# EAGLE design shield (EAGLE 5.11)
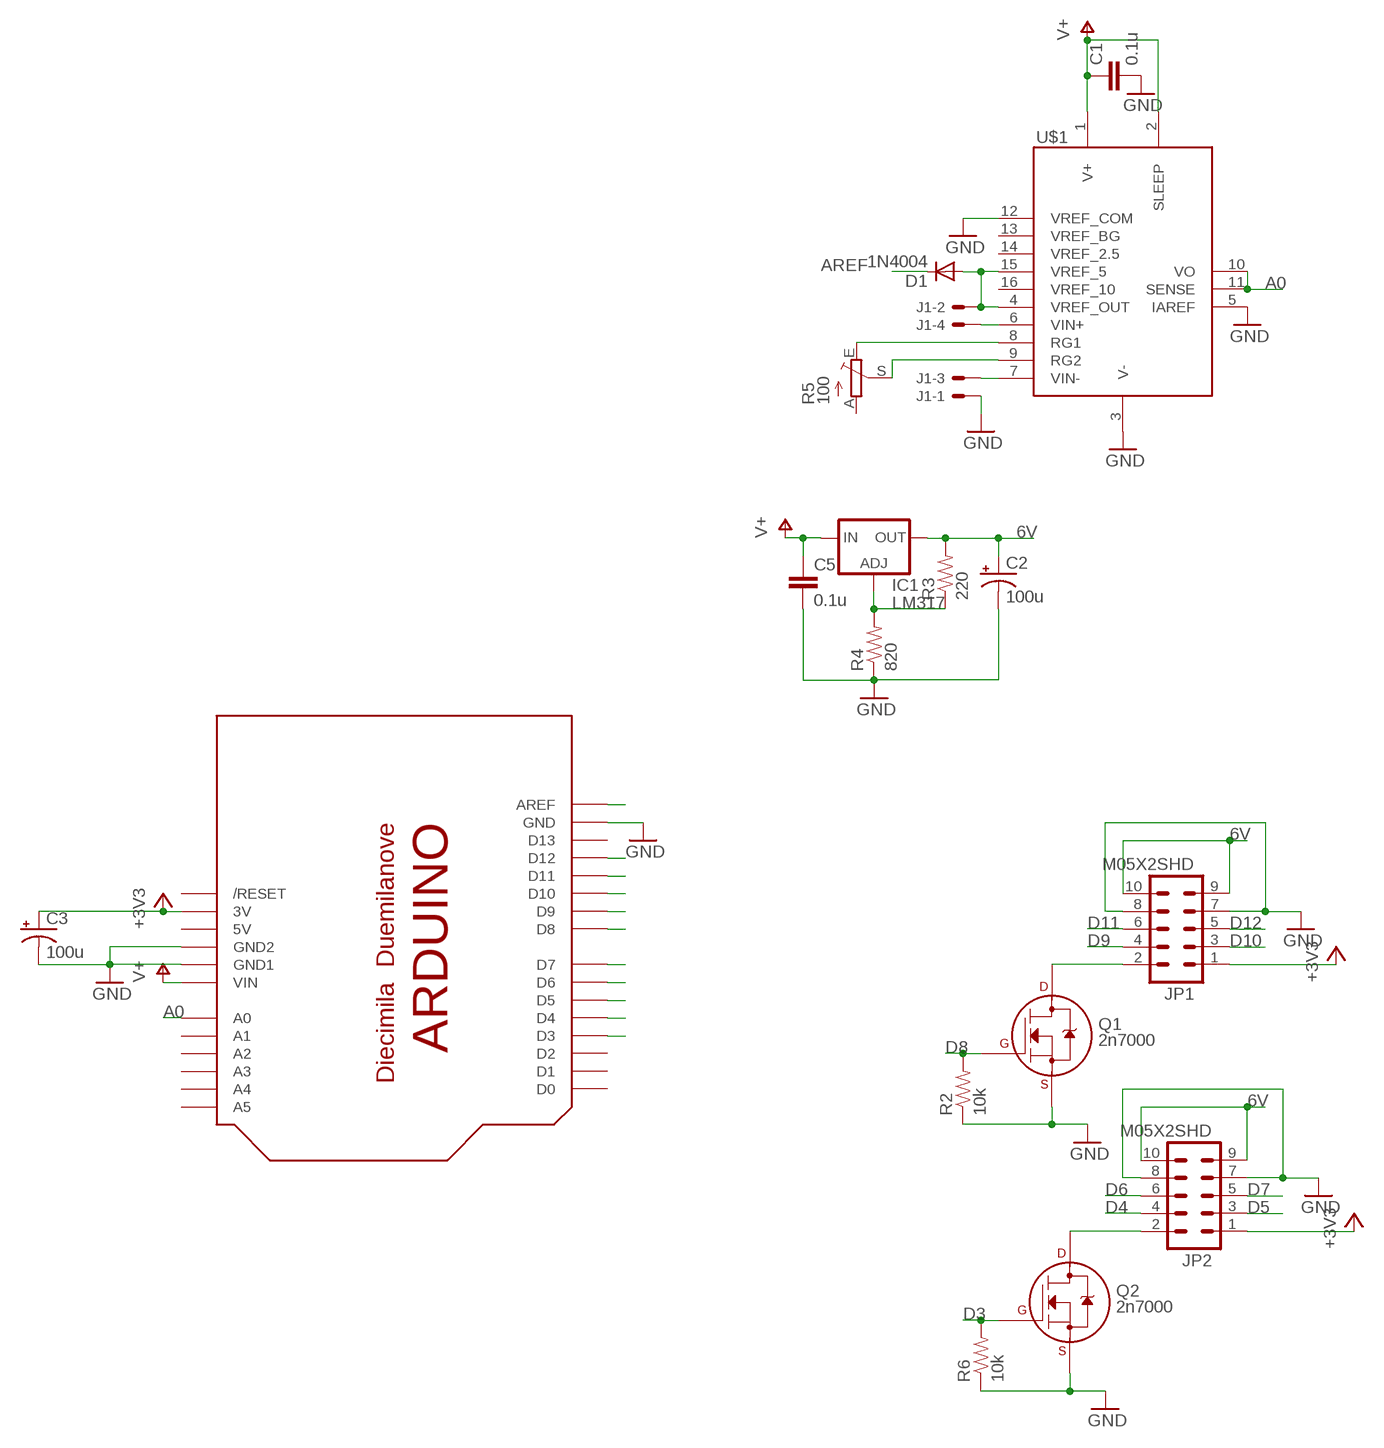
[diagram p0: schematic, sheet 1]

## Parts
C1  0.1u  CAPPTH  [CAP-PTH-SMALL]
C2  100u  CAP_POLPTH1  [CPOL-RADIAL-100UF-25V]
C3  100u  CAP_POLPTH1  [CPOL-RADIAL-100UF-25V]
C5  0.1u  CAPPTH  [CAP-PTH-SMALL]
D1  1N4004  [DO41-10]
IC1  LM317  LM317MABT  [TO220L1]
J1  22-05-7048-04  [7395-04]
JP1  M05X2SHD  [2X5-SHROUDED]
JP2  M05X2SHD  [2X5-SHROUDED]
Q1  2n7000  2N7000_TO92  [TO-92]
Q2  2n7000  2N7000_TO92  [TO-92]
R2  10k  RESISTORPTH-1/4W  [AXIAL-0.4]
R3  220  RESISTORPTH-1/4W  [AXIAL-0.4]
R4  820  RESISTORPTH-1/4W  [AXIAL-0.4]
R5  100  TRIM_EU-S64W  [S64W]
R6  10k  RESISTORPTH-1/4W  [AXIAL-0.4]
U$1  INA125DIP  [DIL16]
U$2  ARDUINOUNO  [ARDUINO]

## Nets
6V: C2.1(+) IC1.2(OUT) JP1.9 JP1.10 JP2.9 JP2.10 R3.P$2
+3V3: C3.1(+) JP1.1 JP2.1 U$2.3V
A0: U$1.10(VO) U$1.11(SENSE) U$2.A0
AREF: D1.C U$2.AREF
D3: Q2.2(G) R6.P$2 U$2.D3
D4: JP2.4 U$2.D4
D5: JP2.3 U$2.D5
D6: JP2.6 U$2.D6
D7: JP2.5 U$2.D7
D8: Q1.2(G) R2.P$2 U$2.D8
D9: JP1.4 U$2.D9
D10: JP1.3 U$2.D10
D11: JP1.6 U$2.D11
D12: JP1.5 U$2.D12
GND: C1.2 C2.2(-) C3.2(-) C5.2 J1.1 JP1.7 JP1.8 JP2.7 JP2.8 Q1.1(S) Q2.1(S) R2.P$1 R4.P$1 R6.P$1 U$1.3(V-) U$1.5(IAREF) U$1.12(VREF_COM) U$2.GND U$2.GND1 U$2.GND2
N$1: D1.A J1.2 U$1.4(VREF_OUT) U$1.15(VREF_5)
N$2: J1.3 U$1.7(VIN-)
N$3: J1.4 U$1.6(VIN+)
N$4: R5.S U$1.9(RG2)
N$5: R5.E U$1.8(RG1)
N$6: IC1.1(ADJ) R3.P$1 R4.P$2
N$7: JP2.2 Q2.3(D)
N$8: JP1.2 Q1.3(D)
V+: C1.1 C5.1 IC1.3(IN) U$1.1(V+) U$1.2(SLEEP) U$2.VIN
Unconnected: R5.A U$1.13(VREF_BG) U$1.14(VREF_2.5) U$1.16(VREF_10) U$2.A1 U$2.A2 U$2.A3 U$2.A4 U$2.A5 U$2.D0 U$2.D1 U$2.D2 U$2.D13 U$2.RESET(/RESET)

## Power pins joined to a net without a drawn wire
5V: U$2.5V

## Library data of the parts
C1 C5 = SparkFun:CAP: Capacitor Standard 0603 ceramic capacitor, and 0.1" leaded capacitor.
C2 C3 = SparkFun:CAP_POL: Capacitor Polarized These are standard SMD and PTH capacitors. Normally 10uF, 47uF, and 100uF in electrolytic and tantalum varieties. Always verify the external diameter of the through hole cap, it varies with capacity, voltage, and manufacturer. The EIA devices should be standard.
D1 = adafruit:1N4004: DIODE General purpose 1N400x type rectifier (With bigger pads) http://www.ladyada.net/library/pcb/eaglelibrary.html
IC1 = v-reg:LM317?*: 500 mA Adjustable Output Positive Voltage Regulator Source: http://www.onsemi.co.jp .. LM317M-D.PDF
J1 = con-molex:22-?-04: CONNECTOR wire to board 2.54 mm (.1 inch) pitch header; OC_FARNELL: unknown; OC_NEWARK: unknown
JP1 JP2 = SparkFun:M05X2: Header 5x2 Standard 10-pin dual row 0.1" header. Commonly used with AVR-ISP. Use with Spark Fun Electronics SKU: PRT-00778
Q1 Q2 = transistors:2N700*: 2N7000, 2N7002, NDS7002A N-channel enhancement mode MOSFET
R2-R4 R6 = SparkFun:RESISTOR: Resistor Basic schematic elements and footprints for 0603, 1206, and PTH resistors.
R5 = pot:TRIM_EU-: POTENTIOMETER
U$1 = ina125:INA125
U$2 = adafruit:ARDUINO: Arduino Diecimila/Duemilanove Make a shield with ease, this package has all the named pins as well as the two mounting drill holes and an outline of the USB and DC power connector. The outline is on the DIMENSION layer, so if your board house uses it they will cut the outline to match. http://www.ladyada.net/library/pcb/eaglelibrary.html

## Board
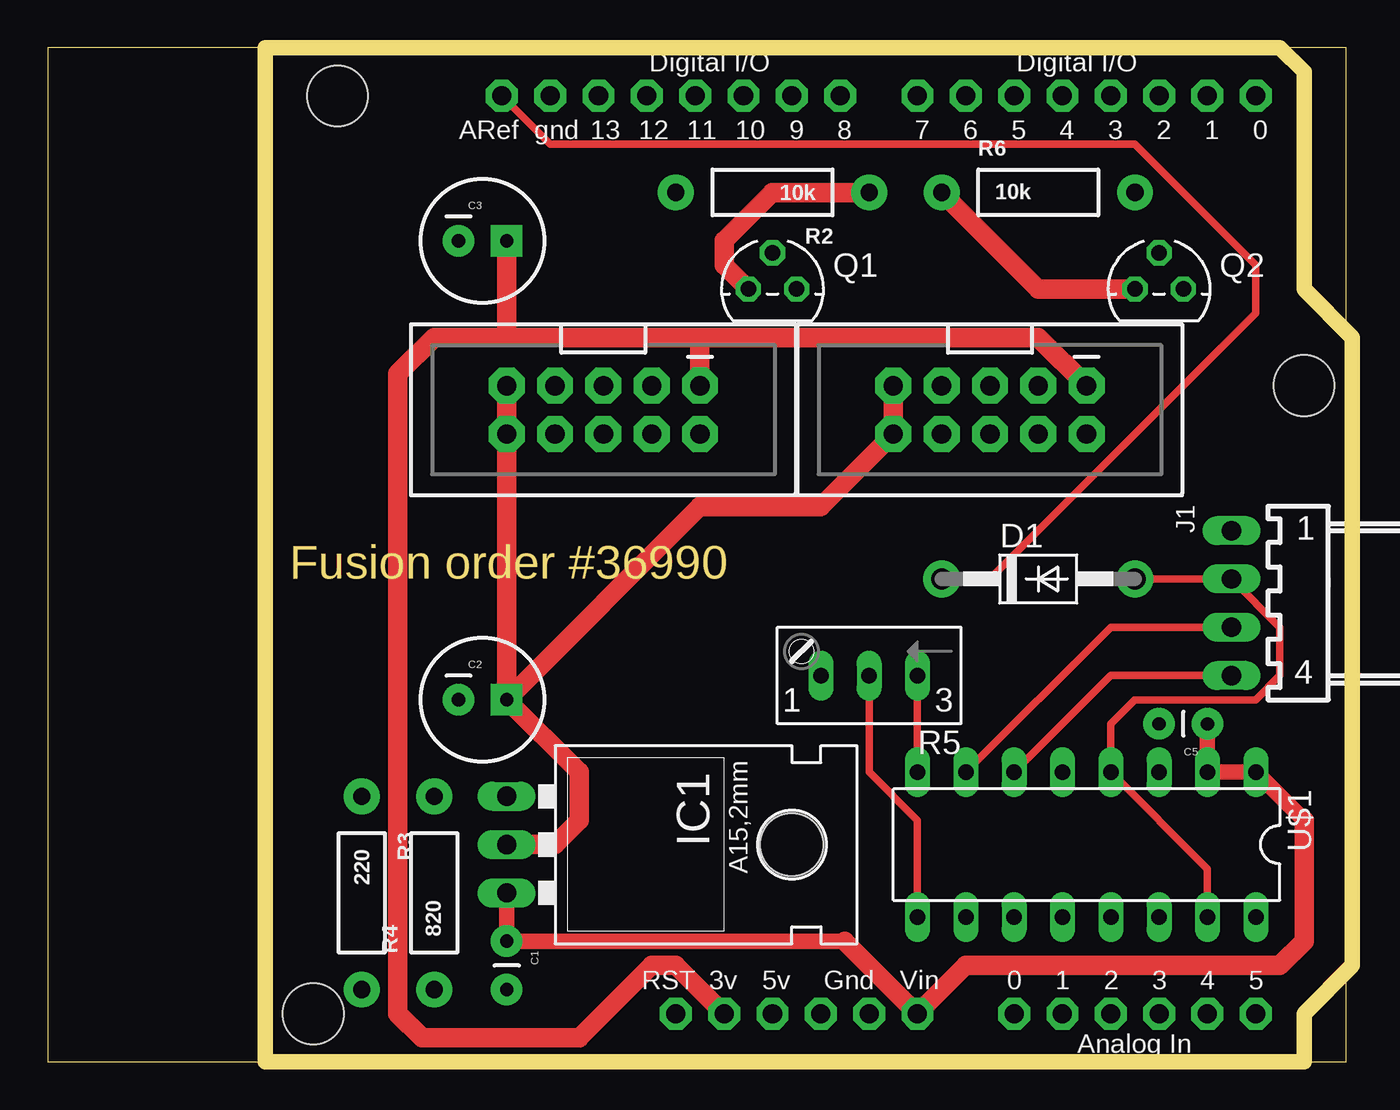
[diagram p1: board, top side]
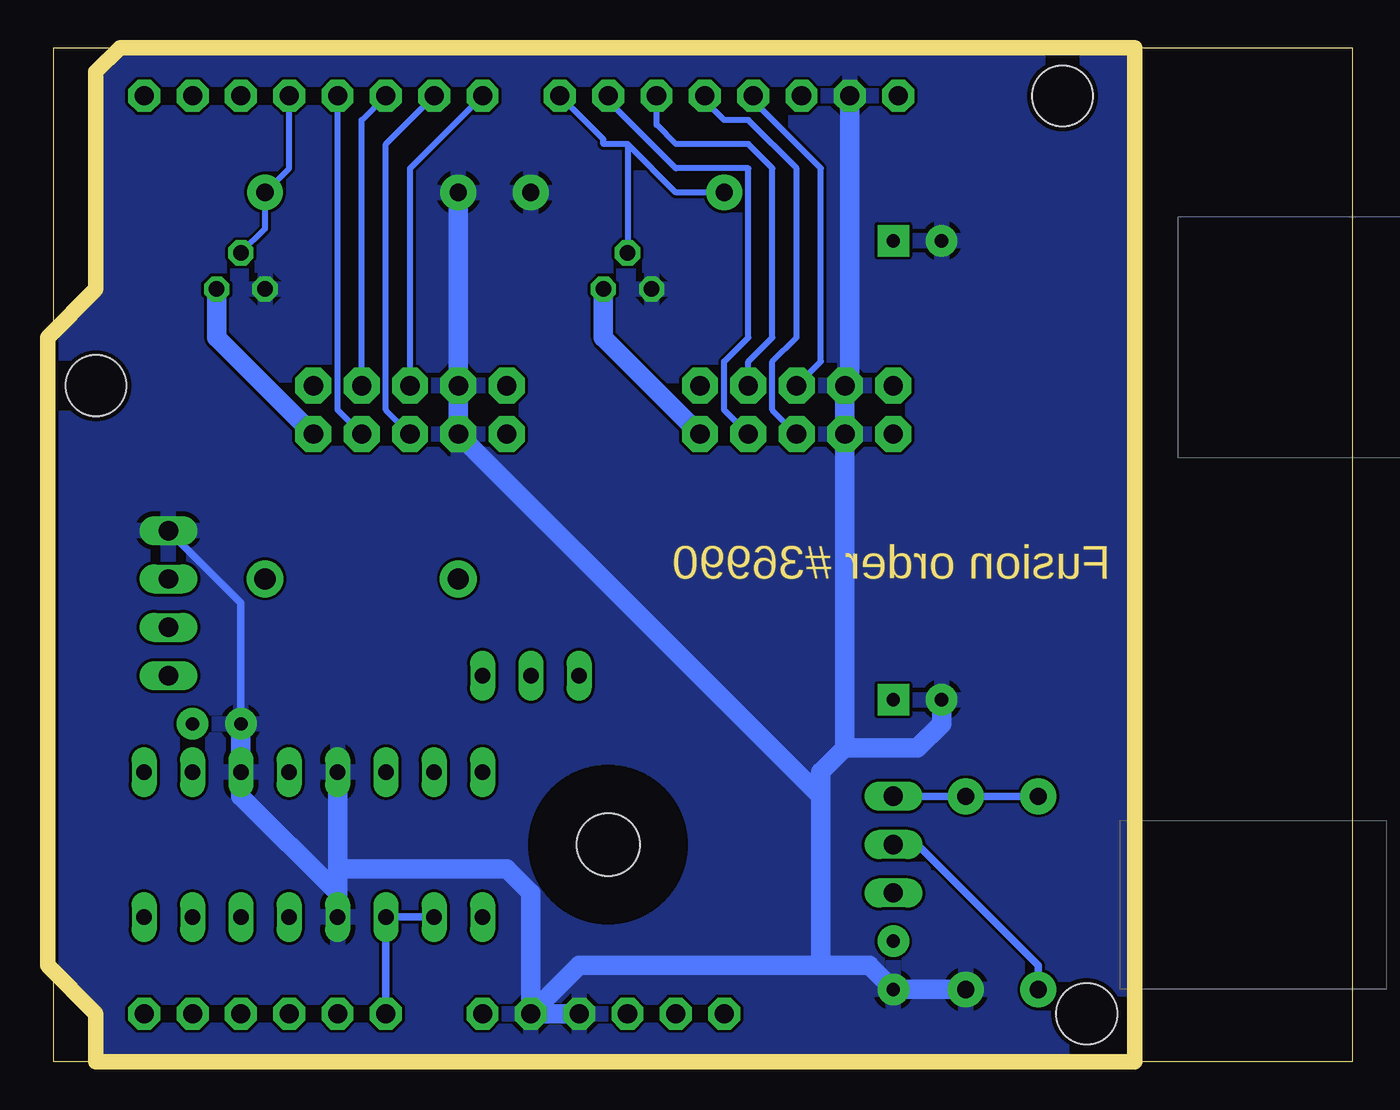
[diagram p2: board, bottom side, seen from below]

Size 56.82 x 53.33 mm. Coordinates in mm from the lower left corner, seen from the top.
Outline: 0,0 56.82,0 56.82,53.33 0,53.33 0,0
Copper layers (1*16): Top 0.035mm / dielectric 1.5mm / Bottom 0.035mm
Design rules "Fusion_eagle_rule_v1.1": minimum track width 6mil, minimum drill 12mil, track to track 6mil, track to pad 6mil, pad to pad 6mil, via to via 6mil, smd to smd 0mil, copper to edge 10mil, drill to drill 10mil, minimum pad ring 10mil, minimum via ring 6mil, stop-mask expansion 2mil, vias tented up to drill 100mil, thermal gap 10mil
Milling: 9 lines

### Footprints (pad centres in the part's own frame; a part is rotated, then mirrored left to right if it is on the bottom)
CAP-PTH-SMALL = drill 0.7 pad 1.651 round: 1 0,0; 2 2.54,0
CPOL-RADIAL-100UF-25V = drill 0.7 pad 1.651 square: 1 1.27,0 | drill 0.7 pad 1.651 round: 2 -1.27,0
DO41-10 = drill 1.118 pad 1.93 round: A 5.08,0; C -5.08,0
TO220L1 = drill 1.016 long: 1 -2.54,-3.81; 2 0,-3.81; 3 2.54,-3.81 | hole 3.302: 0,11.176
7395-04 = drill 1.016 long: 1 3.81,0; 2 1.27,0; 3 -1.27,0; 4 -3.81,0
2X5-SHROUDED = drill 1.016 pad 1.88 octagon: 1 -1.27,5.08; 2 1.27,5.08; 3 -1.27,2.54; 4 1.27,2.54; 5 -1.27,0; 6 1.27,0; 7 -1.27,-2.54; 8 1.27,-2.54; 9 -1.27,-5.08; 10 1.27,-5.08
TO-92 = drill 0.813 octagon: 1 -1.27,0; 2 0,1.905; 3 1.27,0
AXIAL-0.4 = drill 0.9 pad 1.88 round: P$1 -5.08,0; P$2 5.08,0
S64W = drill 0.813 long: A 2.54,1.27; E -2.54,1.27; S 0,1.27
DIL16 = drill 0.813 long: 1 -8.89,-3.81; 2 -6.35,-3.81; 3 -3.81,-3.81; 4 -1.27,-3.81; 5 1.27,-3.81; 6 3.81,-3.81; 7 6.35,-3.81; 8 8.89,-3.81; 9 8.89,3.81; 10 6.35,3.81; 11 3.81,3.81; 12 1.27,3.81; 13 -1.27,3.81; 14 -3.81,3.81; 15 -6.35,3.81; 16 -8.89,3.81
ARDUINO = drill 1 pad 1.676 octagon: 3V 35.56,2.54; 5V 38.1,2.54; A0 50.8,2.54; A1 53.34,2.54; A2 55.88,2.54; A3 58.42,2.54; A4 60.96,2.54; A5 63.5,2.54; AREF 23.876,50.8; D0 63.5,50.8; D1 60.96,50.8; D2 58.42,50.8; D3 55.88,50.8; D4 53.34,50.8; D5 50.8,50.8; D6 48.26,50.8; D7 45.72,50.8; D8 41.656,50.8; D9 39.116,50.8; D10 36.576,50.8; D11 34.036,50.8; D12 31.496,50.8; D13 28.956,50.8; GND 26.416,50.8; GND1 43.18,2.54; GND2 40.64,2.54; RESET 33.02,2.54; VIN 45.72,2.54 | hole 3.2: 15.24,50.8; 66.04,35.56; 13.97,2.54

### Placement (x,y rotation side)
C1  12.7,6.35 270 top
C2  11.43,19.05 0 top
C3  11.43,43.18 0 top
C5  49.53,17.78 180 top
D1  40.64,25.4 0 top
IC1  16.51,11.43 270 top
J1  50.8,24.13 90 top
JP1  17.78,34.29 270 top
JP2  38.1,34.29 270 top
Q1  26.67,40.64 0 top
Q2  46.99,40.64 0 top
R2  26.67,45.72 180 top
R3  5.08,8.89 270 top
R4  8.89,8.89 90 top
R5  31.75,21.59 180 top
R6  40.64,45.72 0 top
U$1  43.18,11.43 180 top
U$2  -11.43,0 0 top

### Tracks (layer width: path | path; a pad name or v marks a point on that pad's centre or on a via)
6V
  Top 1.016: C2.1 16.51,15.24 16.51,12.7 15.24,11.43 IC1.2 | JP1.9 JP1.10 C2.1 | C2.1 22.86,29.21 29.21,29.21 JP2.10 JP2.9
  Bottom 0.406: R3.P$2 5.08,5.08 11.43,11.43 IC1.2
+3V3
  Top 1.016: U$2.3V 21.59,5.08 20.32,5.08 16.51,1.27 8.26,1.27 6.99,2.54 6.99,36.2 8.89,38.1 12.7,38.1 | 12.7,38.1 22.86,38.1 | 22.86,38.1 40.64,38.1 JP2.1 | 22.86,38.1 JP1.1 | 12.7,38.1 C3.1
A0
  Bottom 0.406: U$2.A0 U$1.11 U$1.10
AREF
  Top 0.406: D1.C 38.1,25.4 52.07,39.37 52.07,41.91 45.72,48.26 14.99,48.26 U$2.AREF
D3
  Bottom 0.305: U$2.D3 44.45,46.99 R6.P$2 45.72,43.81 Q2.2
D4
  Bottom 0.305: U$2.D4 41.91,34.29 JP2.4
D5
  Bottom 0.305: U$2.D5 40.64,49.53 JP2.3
D6
  Bottom 0.305: U$2.D6 39.37,48.26 39.37,34.29 JP2.6
D7
  Bottom 0.305: U$2.D7 38.1,46.99 JP2.5
D8
  Bottom 0.305: 26.67,48.26 24.13,45.72 R2.P$2 | 26.67,48.26 Q1.2 | 26.67,48.26 27.94,48.26 27.94,48.51 U$2.D8
D9
  Bottom 0.305: U$2.D9 27.69,50.55 24.13,46.99 20.32,46.99 20.32,38.1 21.59,36.83 21.59,34.29 JP1.4
D10
  Bottom 0.305: U$2.D10 25.15,49.28 24.13,48.26 20.32,48.26 19.05,46.99 19.05,38.1 20.32,36.83 JP1.3
D11
  Bottom 0.305: U$2.D11 22.61,50.55 21.59,49.53 20.32,49.53 17.78,46.99 17.78,38.1 19.05,36.83 19.05,34.29 JP1.6
D12
  Bottom 0.305: U$2.D12 20.07,50.55 16.51,46.99 16.51,36.83 JP1.5
GND
  Top 1.016: R6.P$1 40.64,40.64 Q2.1 | R2.P$1 26.67,45.72 24.13,43.18 24.13,41.91 Q1.1
  Bottom 0.406: J1.1 46.99,24.13 C5.2
  Bottom 1.016: U$2.GND1 29.21,5.08 16.51,5.08 | 16.51,5.08 13.97,5.08 C1.2 R4.P$1 | C2.2 10.16,17.78 11.43,16.51 15.24,16.51 | 15.24,16.51 16.51,15.24 16.51,13.97 | 16.51,5.08 16.51,13.97 | U$2.GND1 U$2.GND2 | 41.91,8.89 U$1.12 | 41.91,10.16 41.91,8.89 | 41.91,10.16 U$1.5 | C5.2 U$1.3 46.99,13.97 41.91,8.89 | U$2.GND1 31.75,8.89 33.02,10.16 41.91,10.16 | 15.24,16.51 JP1.8 JP1.7 14.99,35.81 U$2.GND | 16.51,13.97 JP2.8 JP2.7 R6.P$1
  pour Bottom: 0,0 54.61,0 54.61,2.54 57.15,5.08 57.15,38.1 54.61,40.64 54.61,52.07 53.34,53.34 0,53.34
N$1
  Top 0.406: U$1.15 49.53,10.16 U$1.4 44.45,17.78 45.72,19.05 52.07,19.05 53.34,20.32 53.34,22.86 J1.2 D1.A
N$2
  Top 0.406: J1.3 44.45,22.86 U$1.7
N$3
  Top 0.406: J1.4 44.45,20.32 U$1.6
N$4
  Top 0.406: U$1.9 34.29,12.7 31.75,15.24 R5.S
N$5
  Top 0.406: U$1.8 R5.E
N$6
  Bottom 0.406: IC1.1 R4.P$2 R3.P$1
N$7
  Bottom 1.016: JP2.2 48.26,38.1 Q2.3
N$8
  Bottom 1.016: JP1.2 27.94,38.1 Q1.3
V+
  Top 0.813: C5.1 U$1.2 U$1.1 54.61,12.7 | 30.48,6.35 C1.1 IC1.3
  Top 1.016: 30.48,6.35 U$2.VIN 36.83,5.08 53.34,5.08 54.61,6.35 54.61,12.7

### Text on the board
Milling: Fusion order #36990